# Altium schematic sheet Arduino Board.SchDoc
size C
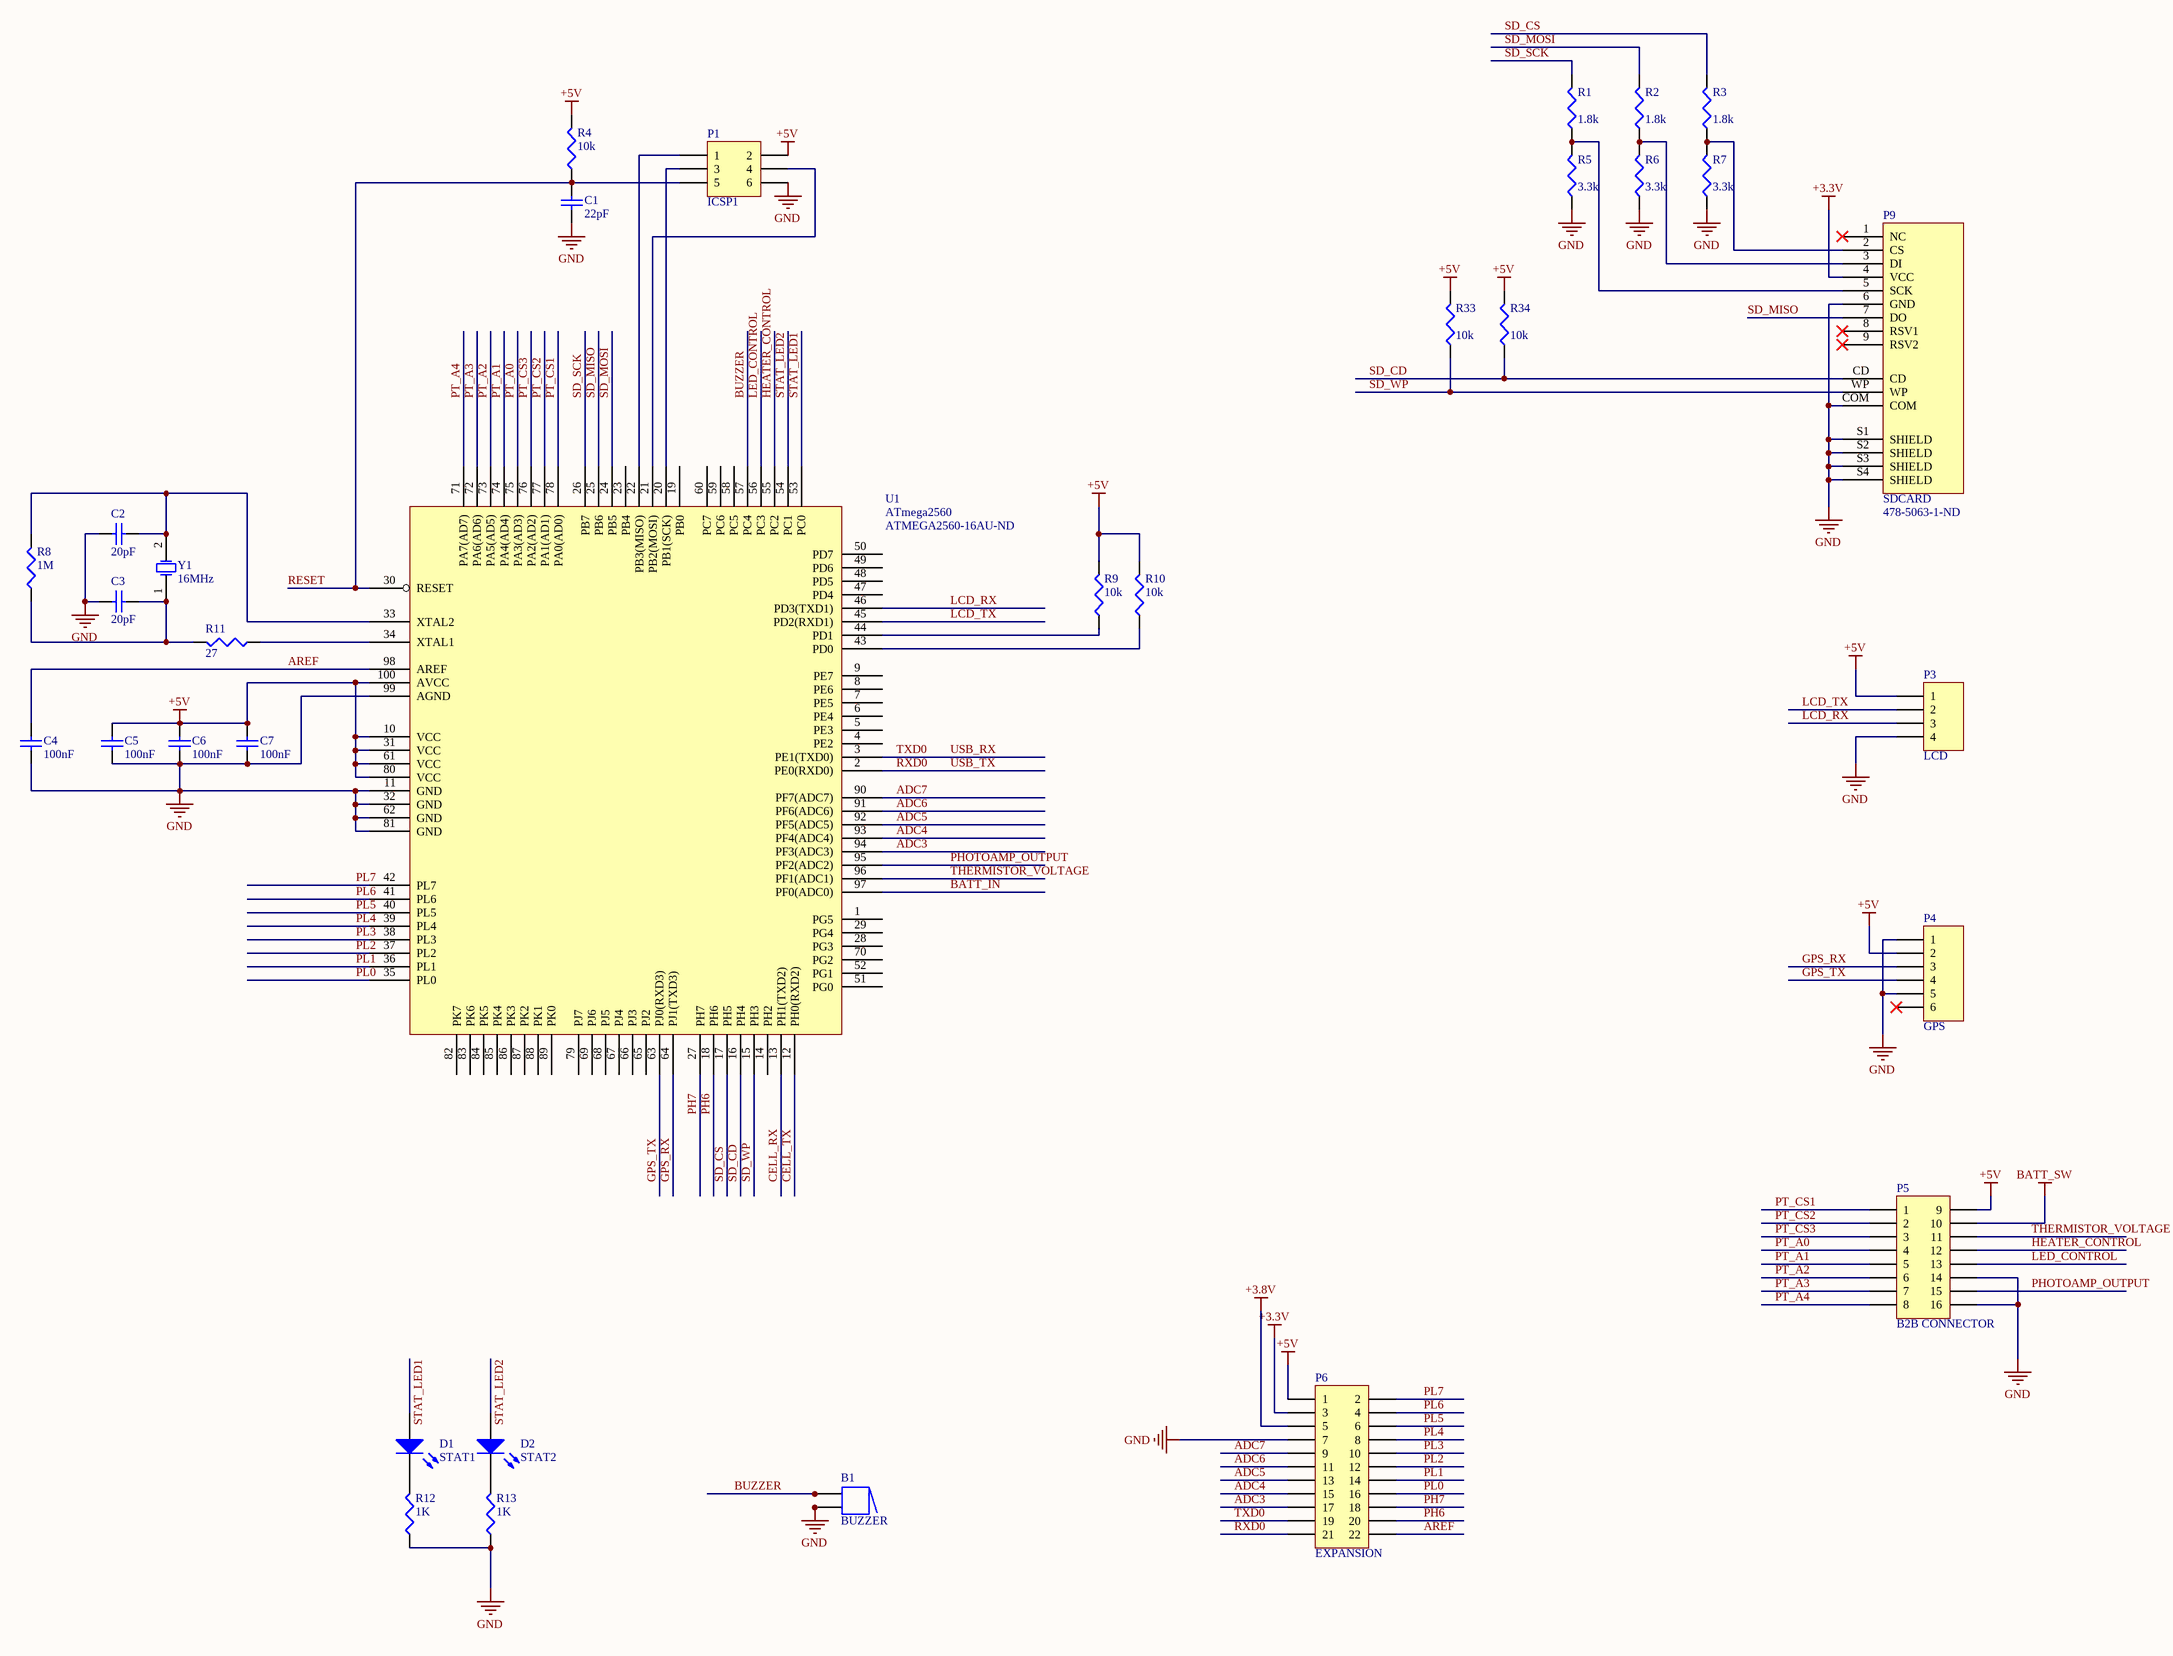
[diagram p0: Arduino Board.SchDoc]

## Parts
B1  BUZZER  [BUZZER]
C1  value 22pF  [C1206]  (hidden comment: Cap Semi)
C2  value 20pF  [C1206]  (hidden comment: Cap Semi)
C3  value 20pF  [C1206]  (hidden comment: Cap Semi)
C4  value 100nF  [C1206]  (hidden comment: Cap Semi)
C5  value 100nF  [C1206]  (hidden comment: Cap Semi)
C6  value 100nF  [C1206]  (hidden comment: Cap Semi)
C7  value 100nF  [C1206]  (hidden comment: Cap Semi)
D1  STAT1  [HDR1X2]
D2  STAT2  [HDR1X2]
P1  ICSP1  [HDR2X3]
P3  LCD  [2MM JST PH - 4 PIN]
P4  GPS  [2mm JST PH - 6 pin]
P5  B2B CONNECTOR  [HDR2X8_CEN]
P6  EXPANSION  [HDR2X11]
P9  SDCARD  Supplier Part Number 1: 478-5063-1-ND  [SDSLOT]
R1  value 1.8k  [RESC3216M]  (hidden comment: Res3)
R2  value 1.8k  [RESC3216M]  (hidden comment: Res3)
R3  value 1.8k  [RESC3216M]  (hidden comment: Res3)
R4  value 10k  [RESC3216M]  (hidden comment: Res3)
R5  value 3.3k  [RESC3216M]  (hidden comment: Res3)
R6  value 3.3k  [RESC3216M]  (hidden comment: Res3)
R7  value 3.3k  [RESC3216M]  (hidden comment: Res3)
R8  value 1M  [RESC3216M]  (hidden comment: Res3)
R9  value 10k  [RESC3216M]  (hidden comment: Res3)
R10  value 10k  [RESC3216M]  (hidden comment: Res3)
R11  value 27  [RESC3216M]  (hidden comment: Res3)
R12  value 1K  [RESC3216M]  (hidden comment: Res3)
R13  value 1K  [RESC3216M]  (hidden comment: Res3)
R33  value 10k  [RESC3216M]  (hidden comment: Res3)
R34  value 10k  [RESC3216M]  (hidden comment: Res3)
U1  ATmega2560  Supplier Part Number 1: ATMEGA2560-16AU-ND  [TSQFP50P1600X1600-100M]
Y1  16MHz  [SMT Crystal]

## Nets
+3.3V: P6.3 P9.4(VCC)
+3.8V: P6.5
+5V: C5.2 C6.2 C7.2 P1.2 P3.1 P4.2 P5.9 P6.1 R4.2 R9.2 R10.2 R33.2 R34.2 U1.10(VCC) U1.31(VCC) U1.61(VCC) U1.80(VCC) U1.100(AVCC)
BATT_SW: P5.10
GND: B1.2 B1.2A C1.1 C2.1 C3.2 C4.1 C5.1 C6.1 C7.1 P1.6 P3.4 P4.1 P4.5 P5.14 P5.16 P6.7 P9.6(GND) P9.COM P9.S1(SHIELD) P9.S2(SHIELD) P9.S3(SHIELD) P9.S4(SHIELD) R5.1 R6.1 R7.1 R12.1 R13.1 U1.11(GND) U1.32(GND) U1.62(GND) U1.81(GND) U1.99(AGND)
ADC3: P6.17 U1.94(PF3(ADC3))
ADC4: P6.15 U1.93(PF4(ADC4))
ADC5: P6.13 U1.92(PF5(ADC5))
ADC6: P6.11 U1.91(PF6(ADC6))
ADC7: P6.9 U1.90(PF7(ADC7))
AREF: C4.2 P6.22 U1.98(AREF)
BATT_IN: U1.97(PF0(ADC0))
BUZZER: B1.1 B1.1A U1.57(PC4)
CELL_RX: U1.13(PH1(TXD2))
CELL_TX: U1.12(PH0(RXD2))
GPS_RX: P4.3 U1.64(PJ1(TXD3))
GPS_TX: P4.4 U1.63(PJ0(RXD3))
HEATER_CONTROL: P5.12 U1.55(PC2)
LCD_RX: P3.3 U1.46(PD3(TXD1))
LCD_TX: P3.2 U1.45(PD2(RXD1))
LED_CONTROL: P5.13 U1.56(PC3)
PH6: P6.20 U1.18(PH6)
PH7: P6.18 U1.27(PH7)
PHOTOAMP_OUTPUT: P5.15 U1.95(PF2(ADC2))
PL0: P6.16 U1.35(PL0)
PL1: P6.14 U1.36(PL1)
PL2: P6.12 U1.37(PL2)
PL3: P6.10 U1.38(PL3)
PL4: P6.8 U1.39(PL4)
PL5: P6.6 U1.40(PL5)
PL6: P6.4 U1.41(PL6)
PL7: P6.2 U1.42(PL7)
PT_A0: P5.4 U1.75(PA3(AD3))
PT_A1: P5.5 U1.74(PA4(AD4))
PT_A2: P5.6 U1.73(PA5(AD5))
PT_A3: P5.7 U1.72(PA6(AD6))
PT_A4: P5.8 U1.71(PA7(AD7))
PT_CS1: P5.1 U1.78(PA0(AD0))
PT_CS2: P5.2 U1.77(PA1(AD1))
PT_CS3: P5.3 U1.76(PA2(AD2))
RESET: C1.2 P1.5 R4.1 U1.30(RESET)
RXD0: P6.21 U1.2(PE0(RXD0))  [also labelled USB_TX]
SD_CD: P9.CD R34.1 U1.16(PH4)
SD_CS: R3.2 U1.17(PH5)
SD_MISO: P9.7(DO) U1.25(PB6)
SD_MOSI: R2.2 U1.24(PB5)
SD_SCK: R1.2 U1.26(PB7)
SD_WP: P9.WP R33.1 U1.15(PH3)
STAT_LED1: D1.1(A) U1.53(PC0)
STAT_LED2: D2.1(A) U1.54(PC1)
THERMISTOR_VOLTAGE: P5.11 U1.96(PF1(ADC1))
TXD0: P6.19 U1.3(PE1(TXD0))  [also labelled USB_RX]
NetC2_2: C2.2 R8.2 U1.33(XTAL2) Y1.2(OSC2)
NetC3_1: C3.1 R8.1 R11.2 Y1.1(OSC1)
NetD1_2: D1.2(K) R12.2
NetD2_2: D2.2(K) R13.2
NetP1_1: P1.1 U1.22(PB3(MISO))
NetP1_3: P1.3 U1.20(PB1(SCK))
NetP1_4: P1.4 U1.21(PB2(MOSI))
NetP9_2: P9.2(CS) R3.1 R7.2
NetP9_3: P9.3(DI) R2.1 R6.2
NetP9_5: P9.5(SCK) R1.1 R5.2
NetR9_1: R9.1 U1.44(PD1)
NetR10_1: R10.1 U1.43(PD0)
NetR11_1: R11.1 U1.34(XTAL1)

Not connected (* = marked no-connect by the designer): P4 6*; P9 1(NC)* 8(RSV1)* 9(RSV2)*; U1 1(PG5) 4(PE2) 5(PE3) 6(PE4) 7(PE5) 8(PE6) 9(PE7) 14(PH2) 19(PB0) 23(PB4) 28(PG3) 29(PG4) 47(PD4) 48(PD5) 49(PD6) 50(PD7) 51(PG0) 52(PG1) 58(PC5) 59(PC6) 60(PC7) 65(PJ2) 66(PJ3) 67(PJ4) 68(PJ5) 69(PJ6) 70(PG2) 79(PJ7) 82(PK7) 83(PK6) 84(PK5) 85(PK4) 86(PK3) 87(PK2) 88(PK1) 89(PK0)

## Library data of the parts
B1 = Buzzer: Magnetic Transducer Buzzer; pin to pad: 1A>1 2A>2; Published: 24-Mar-1999; LatestRevisionDate: 17-Dec-2003; LatestRevisionNote: Schematic revised, PCB Footprint replaced.; DatasheetVersion: 17-Dec-2003; PackageReference: ABSM-1574; Publisher: Altium Limited; PackageDescription: Magnetic Transducer Buzzer; ComponentLink1Description: Manufacturer Link; ComponentLink1URL: http://www.megastar.com/linecard/buzzmode/index.php
C1-C7 = Cap Semi: Capacitor (Semiconductor SIM Model); Published: 8-Jun-2000; LatestRevisionDate: 29-May-2009; LatestRevisionNote: IPC-7351 Footprint Added.; PackageReference: C1206; Publisher: Altium Limited; PackageDescription: Chip Capacitor
D1 D2 = LED3: Typical BLUE SiC LED; Published: 8-Jun-2000; LatestRevisionDate: 17-Dec-2003; LatestRevisionNote: PCB Footprint replaced.; DatasheetVersion: 16-Apr-2002; PackageVersion: 16-Apr-2002; PackageReference: 3.5X2.8X1.9; Publisher: Altium Limited; PackageDescription: SM LED; 2 C-Bend Leads; Body 3.5 x 2.8 x 1.9 mm, inc leads (LxWxH typ)
P1 = Header 3X2: Header, 3-Pin, Dual row; LatestRevisionDate: 17-Jul-2002; LatestRevisionNote: Re-released for DXP Platform.; Publisher: Altium Limited
P3 = Header 4: Header, 4-Pin; LatestRevisionDate: 17-Jul-2002; LatestRevisionNote: Re-released for DXP Platform.; Publisher: Altium Limited
P4 = Header 6: Header, 6-Pin; LatestRevisionDate: 17-Jul-2002; LatestRevisionNote: Re-released for DXP Platform.; Publisher: Altium Limited
P5 = Header 8X2A: Header, 8-Pin, Dual row; LatestRevisionDate: 17-Jul-2002; LatestRevisionNote: Re-released for DXP Platform.; Publisher: Altium Limited
P6 = Header 11X2: Header, 11-Pin, Dual row; LatestRevisionDate: 17-Jul-2002; LatestRevisionNote: Re-released for DXP Platform.; Publisher: Altium Limited
P9 = SDSLOT: Supplier 1: Digi-Key
R1-R13 R33 R34 = Res3: Resistor; Published: 8-Jun-2000; LatestRevisionDate: 29-May-2009; LatestRevisionNote: IPC-7351 Footprint Added.; PackageReference: J1-0603; Publisher: Altium Limited; PackageDescription: Chip Resistor
Y1 = XTAL: Crystal Oscillator; Published: 8-Jun-2000; LatestRevisionDate: 17-Jul-2002; LatestRevisionNote: Re-released for DXP Platform.; PackageReference: R38; Publisher: Altium Limited; PackageDescription: Crystal, Thru-Hole; 2 Leads; Body 3.1 x 8.2 mm (Dia.xH)
U1 = ATmega2560: Supplier 1: Digi-Key